# Altium project Bolometric_bridge.PrjPcb
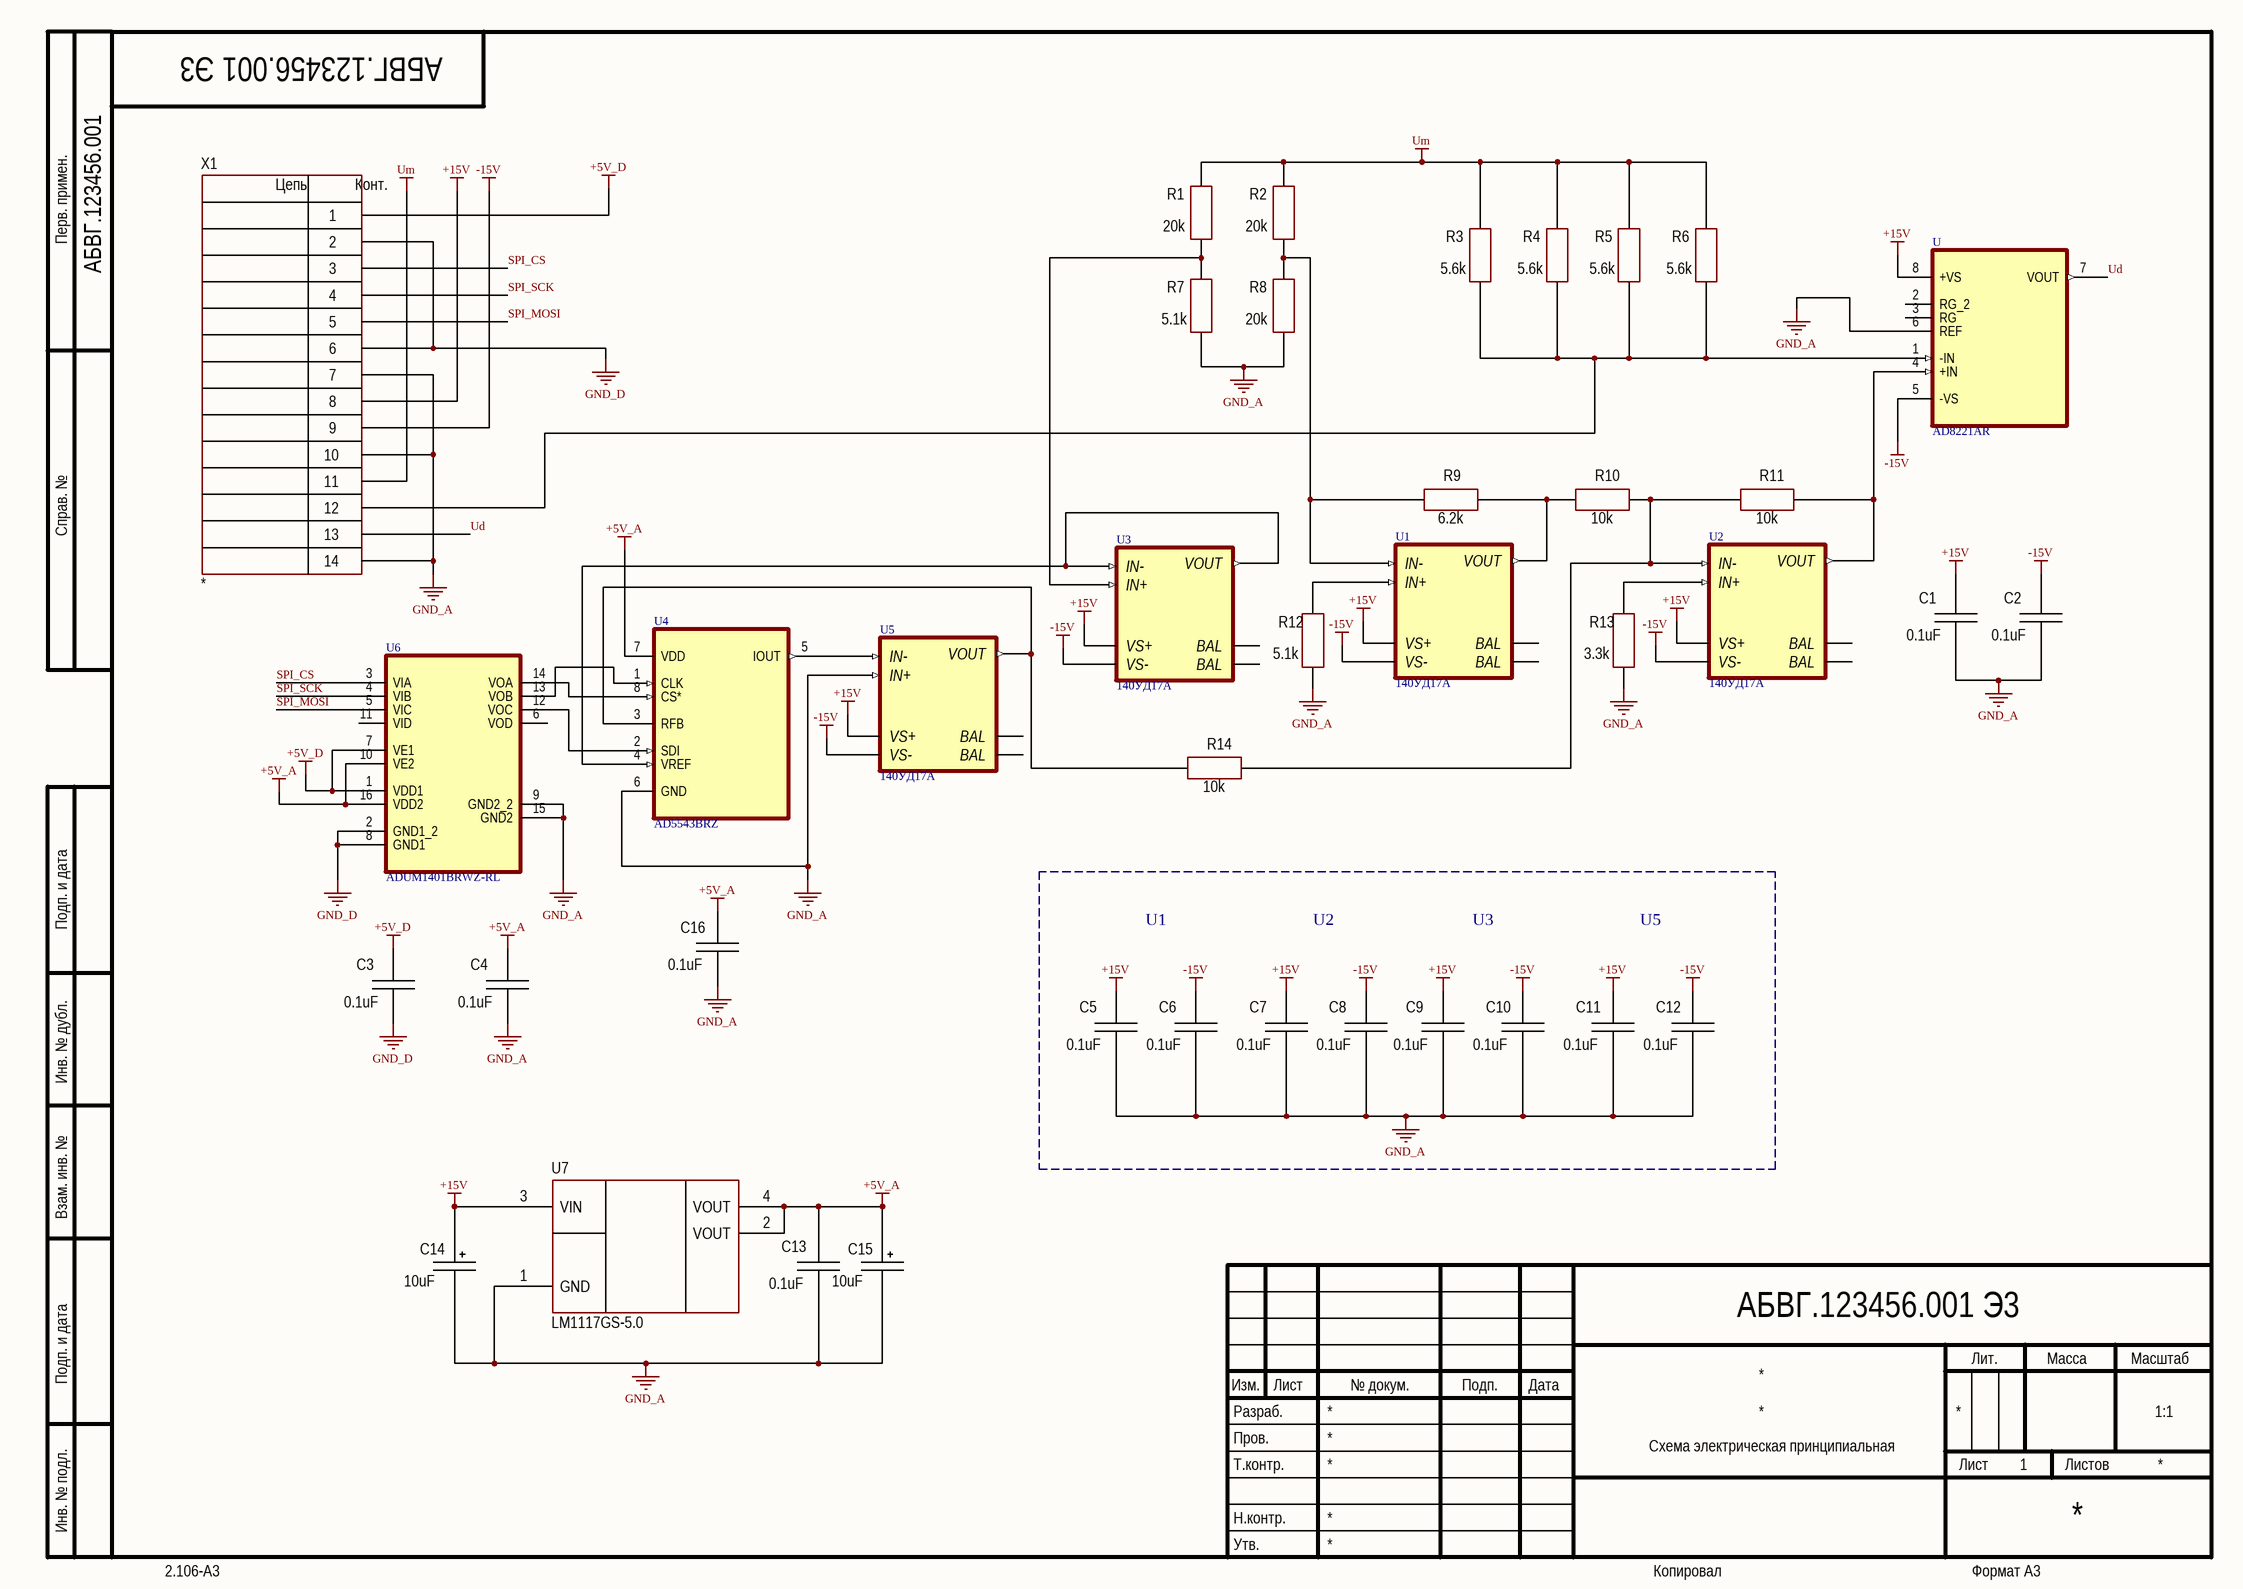
[diagram p0: Sheet.SchDoc]
1 sheet, 39 parts. Net scope: global (net labels, ports and power ports of the same name join across sheets).
Board file: PCB.PcbDoc

## Sheet Sheet.SchDoc
size 420 x 297 mm; Address1: Address1; Address2: Address2; Address3: Address3; Address4: Address4; DocumentNumber: АБВГ.123456.001 Э3; SheetNumber: 1; Scale: 1:1; DocumentType: Схема электрическая принципиальная; FirstReferrence: АБВГ.123456.001

### Parts
C1  0.1uF  [CH1206C]
C2  0.1uF  [CH1206C]
C3  0.1uF  [CH1206C]
C4  0.1uF  [CH1206C]
C5  0.1uF  [CH1206C]
C6  0.1uF  [CH1206C]
C7  0.1uF  [CH1206C]
C8  0.1uF  [CH1206C]
C9  0.1uF  [CH1206C]
C10  0.1uF  [CH1206C]
C11  0.1uF  [CH1206C]
C12  0.1uF  [CH1206C]
C13  0.1uF  [CH1206C]
C14  10uF  [TANTAL_A]
C15  10uF  [TANTAL_A]
C16  0.1uF  [CH1206C]
R1  20k  [CH1206R]
R2  20k  [CH1206R]
R3  5.6k  [CH1206R]
R4  5.6k  [CH1206R]
R5  5.6k  [CH1206R]
R6  5.6k  [CH1206R]
R7  5.1k  [CH1206R]
R8  20k  [CH1206R]
R9  6.2k  [CH1206R]
R10  10k  [CH1206R]
R11  10k  [CH1206R]
R12  5.1k  [CH1206R]
R13  3.3k  [CH1206R]
R14  10k  [CH1206R]
U  AD8221AR  [SOIC127P600X175-8N]
U1  140УД17А  [140УД17А]
U2  140УД17А  [140УД17А]
U3  140УД17А  [140УД17А]
U4  AD5543BRZ  [SOIC127P600X175-8N]
U5  140УД17А  [140УД17А]
U6  ADUM1401BRWZ-RL  [SOIC127P1032X265-16N]
U7  PartNumber: LM1117GS-5.0  [SOT223]
X1  *  [CON: PLS-14]

### Nets
+5V_A: C4.2 C13.2 C15.1 C16.2 U4.7(VDD) U6.10(VE2) U6.16(VDD2) U7.2(VOUT) U7.4(VOUT)
+5V_D: C3.2 U6.1(VDD1) U6.7(VE1) X1.1
+15V: C1.2 C5.2 C7.2 C9.2 C11.2 C14.1 U.8(+VS) U1.8(VS+) U2.8(VS+) U3.8(VS+) U5.8(VS+) U7.3(VIN) X1.8
-15V: C2.2 C6.2 C8.2 C10.2 C12.2 U.5(-VS) U1.5(VS-) U2.5(VS-) U3.5(VS-) U5.5(VS-) X1.9
GND_A: C1.1 C2.1 C4.1 C5.1 C6.1 C7.1 C8.1 C9.1 C10.1 C11.1 C12.1 C13.1 C14.2 C15.2 C16.1 R7.1 R8.1 R12.1 R13.1 U.6(REF) U4.6(GND) U5.4(IN+) U6.9(GND2_2) U6.15(GND2) U7.1(GND) X1.7 X1.10 X1.14
GND_D: C3.1 U6.2(GND1_2) U6.8(GND1) X1.2 X1.6
Um: R1.2 R2.2 R3.2 R4.2 R5.2 R6.2 X1.11
SPI_CS: U6.3(VIA) X1.3
SPI_MOSI: U6.5(VIC) X1.5
SPI_SCK: U6.4(VIB) X1.4
Ud: U.7(VOUT) X1.13
NetR1_1: R1.1 R7.2 U3.4(IN+)
NetR2_1: R2.1 R8.2 R9.1 U1.3(IN-)
NetR3_1: R3.1 R4.1 R5.1 R6.1 U.1(-IN) X1.12
NetR9_2: R9.2 R10.1 U1.7(VOUT)
NetR10_2: R10.2 R11.1 R14.2 U2.3(IN-)
NetR11_2: R11.2 U.4(+IN) U2.7(VOUT)
NetR12_2: R12.2 U1.4(IN+)
NetR13_2: R13.2 U2.4(IN+)
NetR14_1: R14.1 U4.3(RFB) U5.7(VOUT)
NetU3_3: U3.3(IN-) U3.7(VOUT) U4.4(VREF)
NetU4_1: U4.1(CLK) U6.13(VOB)
NetU4_2: U4.2(SDI) U6.12(VOC)
NetU4_5: U4.5(IOUT) U5.3(IN-)
NetU4_8: U4.8(CS*) U6.14(VOA)

Not connected (* = marked no-connect by the designer): U 2(RG_2) 3(RG); U1 1(BAL) 2(BAL); U2 1(BAL) 2(BAL); U3 1(BAL) 2(BAL); U5 1(BAL) 2(BAL); U6 6(VOD) 11(VID)

### Notes on the sheet
- U1
- U2
- U3
- U5
- Перв. примен.
- Справ. №
- Подп. и дата
- Инв. № дубл.
- Взам. инв. №
- Разраб.
- Изм.
- Лист
- № докум.
- Подп.
- Дата
- Лит.
- Масса
- Масштаб
- Пров.
- Т.контр.
- Листов
- Инв. № подл.
- Утв.
- Н.контр.
- 2.106-A3
- Копировал
- Формат А3
- (in symbol 14-Connector) Цепь; Конт.

### Library data of the parts
C1-C13 C16 = Capacitor: Manufacturer: *; Model: *; HelpURL: *; ComponentKind: *; Value: *
C14 C15 = TantalCap: Manufacturer: *; Model: *; HelpURL: *; ComponentKind: *; Value: *
R1-R14 = Resistor: Manufacturer: *; Model: *; HelpURL: *; ComponentKind: *; Value: *
U = AD8221BR: Instrumentation Amplifier 1 Circuit 8-SOIC; MF: Analog Devices; Package: SOIC-8 Analog Devices; Availability: Unavailable; MP: AD8221BR; Value: *; SnapEDA_Link: https://www.snapeda.com/parts/AD8221BR/Analog%20Devices%20Inc./view-part/82856/?ref=snap; Price: None
U1-U3 U5 = 140УД17А: Precision Op Amp
U4 = AD5543BRZ: 16 Bit Digital to Analog Converter 1 8-SOIC; MF: Analog Devices; SnapEDA_Link: https://www.snapeda.com/parts/AD5543BRZ/Analog%20Devices%20Inc./view-part/278340/?ref=snap; Value: *; Purchase-URL: https://pricing.snapeda.com/search/part/AD5543BRZ/?ref=eda; Check_prices: https://www.snapeda.com/parts/AD5543BRZ/Analog%20Devices%20Inc./view-part/278340/?ref=eda; Availability: Good; Price: None; MP: AD5543BRZ; Package: SOIC-8 Analog Devices
U6 = ADUM1401BRWZ-RL: General Purpose Digital Isolator 2500Vrms 4 Channel 10Mbps 25kV/Âµs CMTI 16-SOIC (0.295, 7.50mm Width); MF: Analog Devices; Check_prices: https://www.snapeda.com/parts/ADUM1401BRWZ-RL/Analog%20Devices%20Inc./view-part/284352/?ref=eda; Package: SOIC -16 Analog Devices; Value: *; MP: ADUM1401BRWZ-RL; Price: None; Availability: Good; SnapEDA_Link: https://www.snapeda.com/parts/ADUM1401BRWZ-RL/Analog%20Devices%20Inc./view-part/284352/?ref=snap; Purchase-URL: https://pricing.snapeda.com/search/part/ADUM1401BRWZ-RL/?ref=eda
U7 = LDL1117S33R: Linear voltage regulator; Manufacturer: STMicroelectronics; ValueManufacturerPartNumber: Linear voltage regulator, input 3.9...18V, 0.6V, output 3.3V, 1.2A, -40...+85°C, SOT223; VoltageInput: input 3.9...18V; MaxDropout: 0.6V; CurrentOutput: 1.2A; VoltageOutput: output 3.3V; HelpURL: https://www.digikey.com/product-detail/en/stmicroelectronics/LDL1117S33R/497-17239-1-ND/7102079; Package: SOT223; ComponentType: Linear voltage regulator; Temperature: -40...+85°C
X1 = 14-Connector: Model: *; Manufacturer: *; HelpURL: *; ComponentKind: *